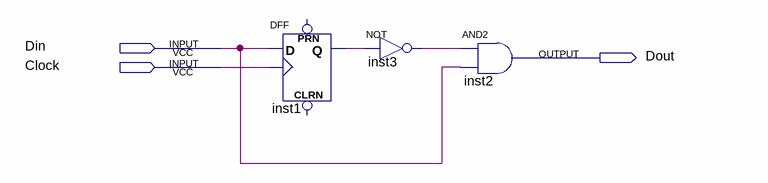
[diagram p0: schematic sheet]
// Quartus schematic Transition_Finder.bdf as structural Verilog: 3 symbols, 3 pins
module Transition_Finder (
  input  Din,
  input  Clock,
  output Dout
);

  wire inst1_q, inst3_out;

  DFF inst1 (.CLK(Clock), .D(Din), .Q(inst1_q));  // open: CLRN, PRN
  not inst3 (inst3_out, inst1_q);
  and inst2 (Dout, inst3_out, Din);
endmodule
